# EAGLE schematic T-11_Version_1_2 (EAGLE 7.1.0)
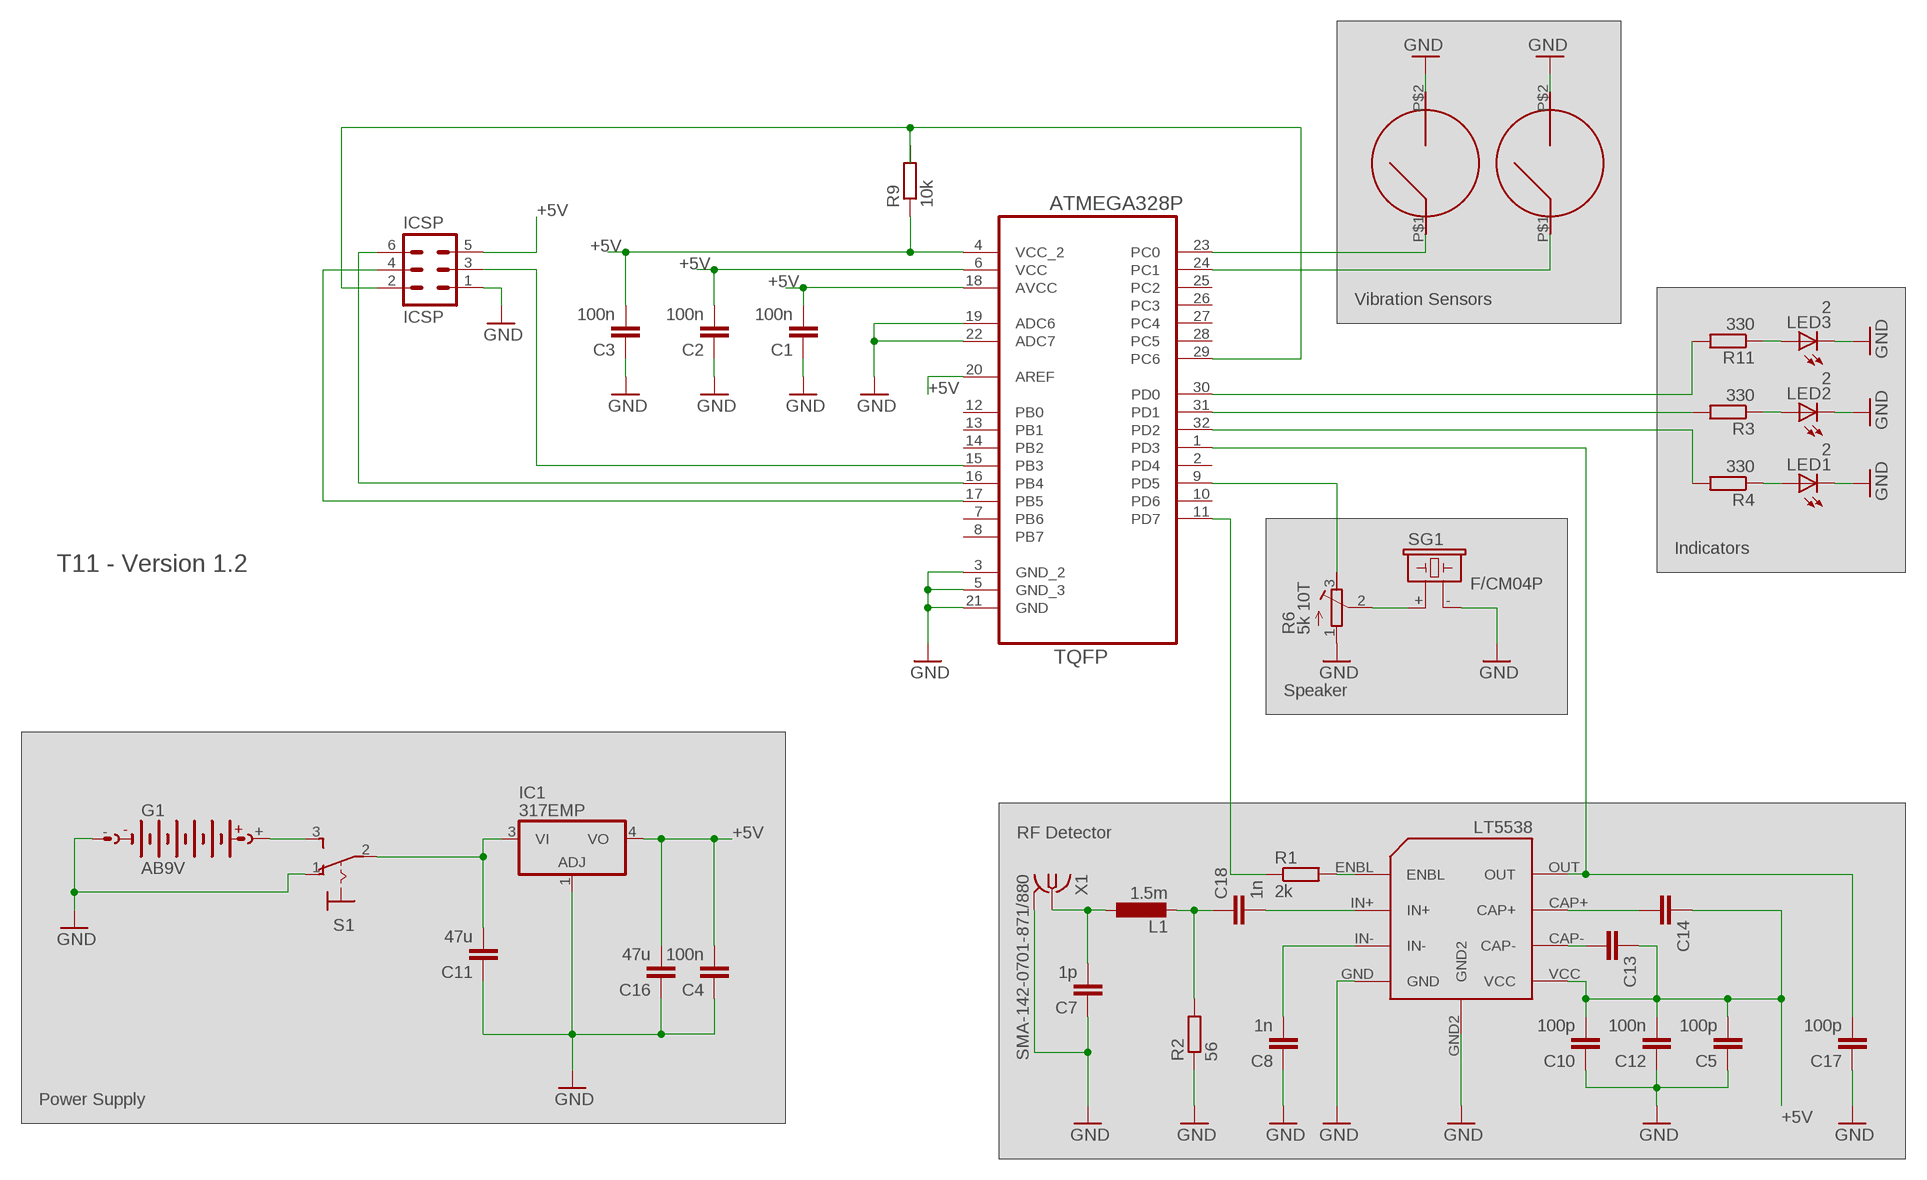
[diagram p0: schematic, sheet 1]

## Parts
C1  100n  C-EUC4532  [C4532]
C2  100n  C-EUC4532  [C4532]
C3  100n  C-EUC4532  [C4532]
C4  100n  C-EUC4532  [C4532]
C5  100p  C-EUC4532  [C4532]
C7  1p  C-EUC4532  [C4532]
C8  1n  C-EUC4532  [C4532]
C10  100p  C-EUC4532  [C4532]
C11  47u  C-EUC4532  [C4532]
C12  100n  C-EUC4532  [C4532]
C13  C-EUC4532  [C4532]
C14  C-EUC4532  [C4532]
C16  47u  C-EUC4532  [C4532]
C17  100p  C-EUC4532  [C4532]
C18  1n  C-EUC4532  [C4532]
G1  AB9V  [AB9V]
IC1  317EMP  [SOT223]
ICSP  ICSP  MA03-2  [MA03-2]
L1  1.5m  L-EUL4532P  [L4532P]
LED1  2  LED3MM  [LED3MM]
LED2  2  LED3MM  [LED3MM]
LED3  2  LED3MM  [LED3MM]
R1  2k  R-EU_R3225  [R3225]
R2  56  R-EU_R3225  [R3225]
R3  330  R-EU_R3225  [R3225]
R4  330  R-EU_R3225  [R3225]
R6  5k 10T  R-TRIMMTS63Y  [RTRIMTS63Y]
R9  10k  R-EU_R3225  [R3225]
R11  330  R-EU_R3225  [R3225]
S1  320-916  [320-916]
SG1  F/CM04P  [F/CM04P]
U1  ATMEGA328P-AU  [QFP80P900X900X120-32N]
U$1  LT5538  [LT5538]
U$2  SW-1801X  [SW-1801X]
U$3  SW-1801X  [SW-1801X]
X1  SMA-142-0701-871/880  [SMA-142-0701-871]

## Nets
+5V: C1.2 C2.2 C3.2 C4.2 C5.2 C10.2 C12.2 C13.1 C14.1 C16.2 IC1.4(VO) ICSP.5 R9.1 U1.4(VCC_2) U1.6(VCC) U1.18(AVCC) U1.20(AREF) U$1.VCC
ADJ_SPEAKER: R6.2(S) SG1.+
ANT_IN_1: C7.2 L1.1 X1.1
ANT_IN_2: C18.1 L1.2 R2.2
GND: C1.1 C2.1 C3.1 C4.1 C5.1 C7.1 C8.1 C10.1 C11.1 C12.1 C16.1 C17.1 G1.- IC1.1(ADJ) ICSP.1 LED1.K(C) LED2.K(C) LED3.K(C) R2.1 R6.1(A) S1.1(O) SG1.- U1.3(GND_2) U1.5(GND_3) U1.19(ADC6) U1.21(GND) U1.22(ADC7) U$1.GND U$1.GND2 U$2.P$2 U$3.P$2 X1.2@1 X1.2@2 X1.2@3 X1.2@4
INDICATOR_1: R4.2 U1.32(PD2)
INDICATOR_2: R3.2 U1.31(PD1)
INDICATOR_3: R11.2 U1.30(PD0)
MISO: ICSP.6 U1.16(PB4)
MOSI: ICSP.3 U1.15(PB3)
N$3: LED3.A R11.1
N$4: G1.+ S1.3(S)
N$5: C18.2 U$1.IN+
N$6: R1.2 U$1.ENBL
N$8: C14.2 U$1.CAP+
N$9: C13.2 U$1.CAP-
N$20: LED1.A R4.1
N$21: LED2.A R3.1
PS_VIN: C11.2 IC1.3(VI) S1.2(P)
RESET: ICSP.2 R9.2 U1.29(PC6)
RF_ENABLE: R1.1 U1.11(PD7)
RF_IN-: C8.2 U$1.IN-
RF_OUT: C17.2 U1.1(PD3) U$1.OUT
SCK: ICSP.4 U1.17(PB5)
SPEAKER: R6.3(E) U1.9(PD5)
VIB_1: U1.24(PC1) U$2.P$1
VIB_2: U1.23(PC0) U$3.P$1
Unconnected: U1.2(PD4) U1.7(PB6) U1.8(PB7) U1.10(PD6) U1.12(PB0) U1.13(PB1) U1.14(PB2) U1.25(PC2) U1.26(PC3) U1.27(PC4) U1.28(PC5)

## Notes on the sheet
- Vibration Sensors
- Indicators
- T11 - Version 1.2
- Speaker
- RF Detector
- Power Supply

## Library data of the parts
C1-C5 C7 C8 C10-C14 C16-C18 = rcl:C-EU: CAPACITOR, European symbol
G1 = battery:AB9V: 9-V BATTERY CLIP
IC1 = linear:*317: Positive VOLTAGE REGULATOR
ICSP = con-lstb:MA03-2: PIN HEADER; OC_FARNELL: unknown; OC_NEWARK: unknown
L1 = rcl:L-EU: INDUCTOR, European symbol
LED1-LED3 = led:LED: LED OSRAM: - CHIPLED LG R971, LG N971, LY N971, LG Q971, LY Q971, LO R971, LY R971 LH N974, LH R974 LS Q976, LO Q976, LY Q976 LO Q996 - Hyper CHIPLED LW Q18S LB Q993, LB Q99A, LB R99A - SideLED LS A670, LO A670, LY A670, LG A670, LP A670 LB A673, LV A673, LT A673, LW A673 LH A674 LY A675 LS A676, LA A676, LO A676, LY A676, LW A676 LS A679, LY A679, LG A679 - Hyper Micro SIDELED® LS Y876, LA Y876, LO Y876, LY Y876 LT Y87S - SmartLED LW L88C, LW L88S LB L89C, LB L89S, LG L890 LS L89K, LO L89K, LY L89K LS L896, LA L896, LO L896, LY L896 - TOPLED LS T670, LO T670, LY T670, LG T670, LP T670 LSG T670, LSP T670, LSY T670, LOP T670, LYG T670 LG T671, LOG T671, LSG T671 LB T673, LV T673, LT T673, LW T673 LH T674 LS T676, LA T676, LO T676, LY T676, LB T676, LH T676, LSB T676, LW T676 LB T67C, LV T67C, LT T67C, LS T67K, LO T67K, LY T67K, LW E67C LS E67B, LA E67B, LO E67B, LY E67B, LB E67C, LV E67C, LT E67C LW T67C LS T679, LY T679, LG T679 LS T770, LO T770, LY T770, LG T770, LP T770 LB T773, LV T773, LT T773, LW T773 LH T774 LS E675, LA E675, LY E675, LS T675 LS T776, LA T776, LO T776, LY T776, LB T776 LHGB T686 LT T68C, LB T68C - Hyper Mini TOPLED® LB M676 - Mini TOPLED Santana® LG M470 LS M47K, LO M47K, LY M47K Source: http://www.osram.convergy.de LUXEON: - LUMILED® LXK2-PW12-R00, LXK2-PW12-S00, LXK2-PW14-U00, LXK2-PW14-V00 LXK2-PM12-R00, LXK2-PM12-S00, LXK2-PM14-U00 LXK2-PE12-Q00, LXK2-PE12-R00, LXK2-PE12-S00, LXK2-PE14-T00, LXK2-PE14-U00 LXK2-PB12-K00, LXK2-PB12-L00, LXK2-PB12-M00, LXK2-PB14-N00, LXK2-PB14-P00, LXK2-PB14-Q00 LXK2-PR12-L00, LXK2-PR12-M00, LXK2-PR14-Q00, LXK2-PR14-R00 LXK2-PD12-Q00, LXK2-PD12-R00, LXK2-PD12-S00 LXK2-PH12-R00, LXK2-PH12-S00 LXK2-PL12-P00, LXK2-PL12-Q00, LXK2-PL12-R00 Source: www.luxeon.com KINGBRIGHT: KA-3528ASYC Source: www.kingbright.com
R1-R4 R9 R11 = rcl:R-EU_: RESISTOR, European symbol
R6 = rcl:R-TRIMM: Trimm resistor
S1 = switch:320-916: TOGGLE SWITCH distributor RS Components
SG1 = buzzer:F/CM04P: BUZZER Source: Buerklin; OC_FARNELL: unknown; OC_NEWARK: unknown
U1 = Ava:ATMEGA328P-AU; DESCRIPTION: 8-bit Microcontroller with In-System Programmable Flash; MPN: ATMEGA328P-AU; OC_FARNELL: 1715486; OC_NEWARK: 14R4631; PACKAGE: TQFP-32; SUPPLIER: Atmel
U$1 = LT5538:LT5538
U$2 U$3 = SW18xxx:SW-1801X
X1 = con-coax:SMA-: SMA 50 Ohm End Launch Jack Receptacle - Round Contact Johnson Components Source: www.johnsoncomponents.com .. J502-ND.pdf; MF: JOHNSON COMPONENTS; MPN: 142-0701-871; OC_FARNELL: 1339835; OC_NEWARK: 91B6105